# Altium schematic sheet MSXII_Controller_Breakout.SchDoc: Controller Board Breakout
size Letter; Author: Kevin Chen, Taiping Li, Titus Chow; Revision: 3.0; SheetNumber: 1; SheetTotal: 2; Website: www.uwmidsun.com
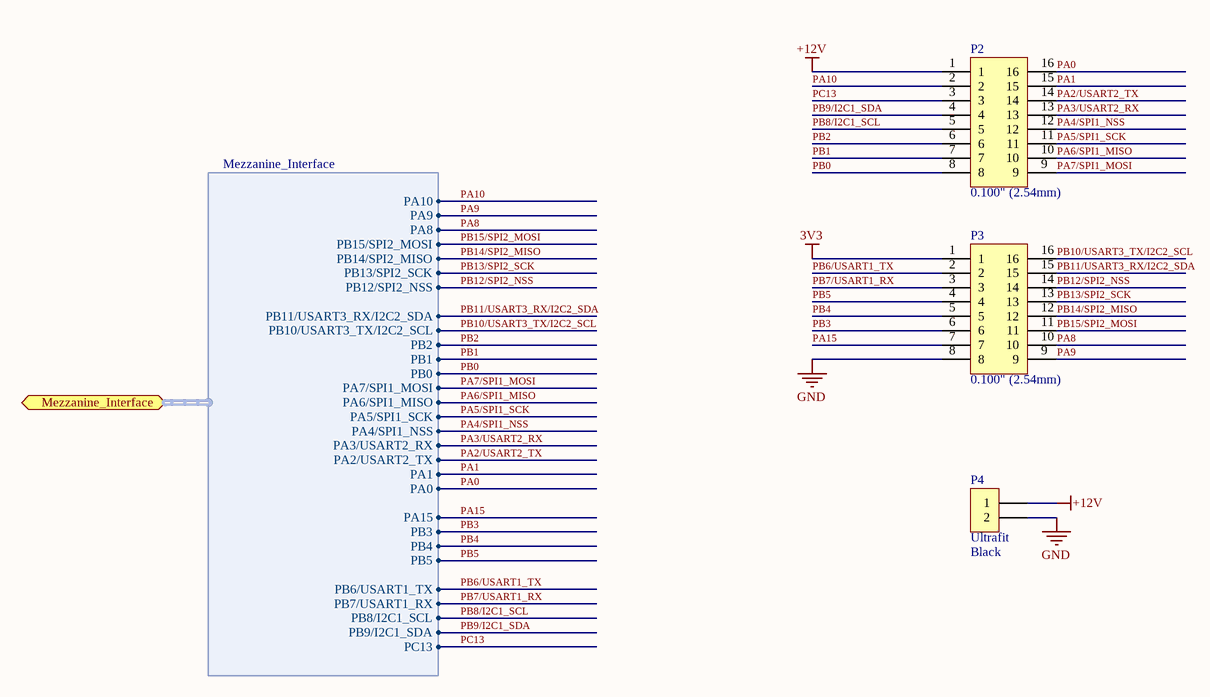
[diagram p0: MSXII_Controller_Breakout.SchDoc]

## Parts
P2  Pitch - Mating: 0.100" (2.54mm)  [CONN, 16POS 0.100" Header]  (hidden comment: 16POS)
P3  Pitch - Mating: 0.100" (2.54mm)  [CONN, 16POS 0.100" Header]  (hidden comment: 16POS)
P4  Insulation Color: Black  Series: Ultrafit  [CONN, 2POS ULTRA-FIT]  (hidden comment: CONN 2POS ULTRA-FIT 0.138")

## Ports
Mezzanine_Interface (harness Mezzanine_Interface)

## Harnesses
Mezzanine_Interface: PA10, PA9, PA8, PB15/SPI2_MOSI, PB14/SPI2_MISO, PB13/SPI2_SCK, PB12/SPI2_NSS, PB11/USART3_RX/I2C2_SDA, PB10/USART3_TX/I2C2_SCL, PB2, PB1, PB0, PA7/SPI1_MOSI, PA6/SPI1_MISO, PA5/SPI1_SCK, PA4/SPI1_NSS, PA3/USART2_RX, PA2/USART2_TX, PA1, PA0, PA15, PB3, PB4, PB5, PB6/USART1_TX, PB7/USART1_RX, PB8/I2C1_SCL, PB9/I2C1_SDA, PC13

## Nets
3V3: P3.1
+12V: P2.1 P4.1
GND: P3.8 P4.2
PA0: P2.16 ; port Mezzanine_Interface.PA0
PA1: P2.15 ; port Mezzanine_Interface.PA1
PA2/USART2_TX: P2.14 ; port Mezzanine_Interface.PA2/USART2_TX
PA3/USART2_RX: P2.13 ; port Mezzanine_Interface.PA3/USART2_RX
PA4/SPI1_NSS: P2.12 ; port Mezzanine_Interface.PA4/SPI1_NSS
PA5/SPI1_SCK: P2.11 ; port Mezzanine_Interface.PA5/SPI1_SCK
PA6/SPI1_MISO: P2.10 ; port Mezzanine_Interface.PA6/SPI1_MISO
PA7/SPI1_MOSI: P2.9 ; port Mezzanine_Interface.PA7/SPI1_MOSI
PA8: P3.10 ; port Mezzanine_Interface.PA8
PA9: P3.9 ; port Mezzanine_Interface.PA9
PA10: P2.2 ; port Mezzanine_Interface.PA10
PA15: P3.7 ; port Mezzanine_Interface.PA15
PB0: P2.8 ; port Mezzanine_Interface.PB0
PB1: P2.7 ; port Mezzanine_Interface.PB1
PB2: P2.6 ; port Mezzanine_Interface.PB2
PB3: P3.6 ; port Mezzanine_Interface.PB3
PB4: P3.5 ; port Mezzanine_Interface.PB4
PB5: P3.4 ; port Mezzanine_Interface.PB5
PB6/USART1_TX: P3.2 ; port Mezzanine_Interface.PB6/USART1_TX
PB7/USART1_RX: P3.3 ; port Mezzanine_Interface.PB7/USART1_RX
PB8/I2C1_SCL: P2.5 ; port Mezzanine_Interface.PB8/I2C1_SCL
PB9/I2C1_SDA: P2.4 ; port Mezzanine_Interface.PB9/I2C1_SDA
PB10/USART3_TX/I2C2_SCL: P3.16 ; port Mezzanine_Interface.PB10/USART3_TX/I2C2_SCL
PB11/USART3_RX/I2C2_SDA: P3.15 ; port Mezzanine_Interface.PB11/USART3_RX/I2C2_SDA
PB12/SPI2_NSS: P3.14 ; port Mezzanine_Interface.PB12/SPI2_NSS
PB13/SPI2_SCK: P3.13 ; port Mezzanine_Interface.PB13/SPI2_SCK
PB14/SPI2_MISO: P3.12 ; port Mezzanine_Interface.PB14/SPI2_MISO
PB15/SPI2_MOSI: P3.11 ; port Mezzanine_Interface.PB15/SPI2_MOSI
PC13: P2.3 ; port Mezzanine_Interface.PC13

## Notes on the sheet
- Project:
- Title:
- Size:
- Project Lead:
- Letter
- Revision:
- University of Waterloo
- 200 University Ave W
- Waterloo, ON, Canada
- N2L 3E9
- Date:
- Sheet
- of
- Website:

## Library data of the parts
P2 P3 = CONN 16POS HEADR MALE 0.1": CONN HEADER .100" DUAL STR 16POS; Manufacturer 1: Sullins Connector Solutions; Manufacturer Part Number 1: PREC008DAAN-RC; Connector Type: Header, Breakaway; Style: Board to Board or Cable; Shrouding: Unshrouded; Number of Positions: 16; Number of Positions Loaded: All; Contact Length - Mating: 0.230" (5.84mm); Contact Length - Post: 0.120" (3.05mm); Overall Contact Length: 0.448" (11.39mm); Material Flammability Rating: UL94 V-0; Current Rating: 3A per Contact; Supplier 1: Digi-Key; Supplier Part Number 1: S2012EC-08-ND; Packaging: Bulk; Part Status: Active; Contact Type: Male Pin; Number of Rows: 2; Row Spacing - Mating: 0.100" (2.54mm); Mounting Type: Through Hole; Termination: Solder; Fastening Type: -; Insulation Height: 0.098" (2.50mm); Contact Shape: Square; Contact Finish - Mating: Tin; Contact Finish Thickness - Mating: -; Contact Finish - Post: Tin; Contact Material: Brass; Insulation Material: Polybutylene Terephthalate (PBT); Operating Temperature: -40°C ~ 105°C; Ingress Protection: -; Insulation Color: Black; Mated Stacking Heights: -; Contact Finish Thickness - Post: -; ComponentLink1URL: http://sullinscorp.com/drawings/294___R__C_____D___N-RC,_11636.pdf; ComponentLink1Description: http://sullinscorp.com/drawings/294___R__C_____D___N-RC,_11636.pdf; Voltage: -
P4 = CONN 2POS ULTRA-FIT 0.138": 2 Positions Header, Shrouded Connector 0.138" (3.50mm) Through Hole Gold; Manufacturer: Molex, LLC; Manufacturer Part Number: 1722871102; Style: Board to Cable/Wire; Shrouding: Shrouded - 4 Wall; Number of Positions: 2; Number of Positions Loaded: All; Contact Length - Post: 0.126" (3.20mm); Material Flammability Rating: UL94 V-0; Voltage Rating: 400V; Mated Stacking Heights: 26.99mm; Supplier 1: Digi-Key; RoHS: RoHS Compliant; Category: Connectors, Interconnects; Stock 1: 2637; Pricing 1: 1=1.09, 10=0.953, 25=0.8968, 50=0.8592, 100=0.8218, 250=0.74712, 500=0.67242, 1000=0.5977, 2500=0.54166 (CAD); Packaging: Tray; Part Status: Active; Connector Type: Header; Contact Type: Male Pin; Pitch - Mating: 0.138" (3.50mm); Number of Rows: 1; Row Spacing - Mating: -; Mounting Type: Through Hole; Termination: Solder; Fastening Type: Latch Holder; Contact Length - Mating: -; Overall Contact Length: -; Insulation Height: 0.465" (11.80mm); Contact Shape: Square; Contact Finish - Mating: Tin; Contact Finish Thickness - Mating: 60µin (1.52µm); Contact Finish - Post: Tin; Contact Material: Copper Alloy; Insulation Material: Liquid Crystal Polymer (LCP); Features: Board Guide, Solder Retention; Operating Temperature: -40°C ~ 105°C; Ingress Protection: -; Current Rating: -; Contact Finish Thickness - Post: 60µin (1.52µm); Applications: Automotive, General Purpose, Industrial, Lighting, Medical, Military, Telecommunications; ComponentLink1URL: http://www.molex.com/pdm_docs/sd/1722871102_sd.pdf; ComponentLink1Description: http://www.molex.com/pdm_docs/sd/1722871102_sd.pdf; Supplier Part Number 1: WM11701-ND